# Altium schematic sheet Instrument_Design.SchDoc
size A2; SheetNumber: 1; SheetTotal: 1
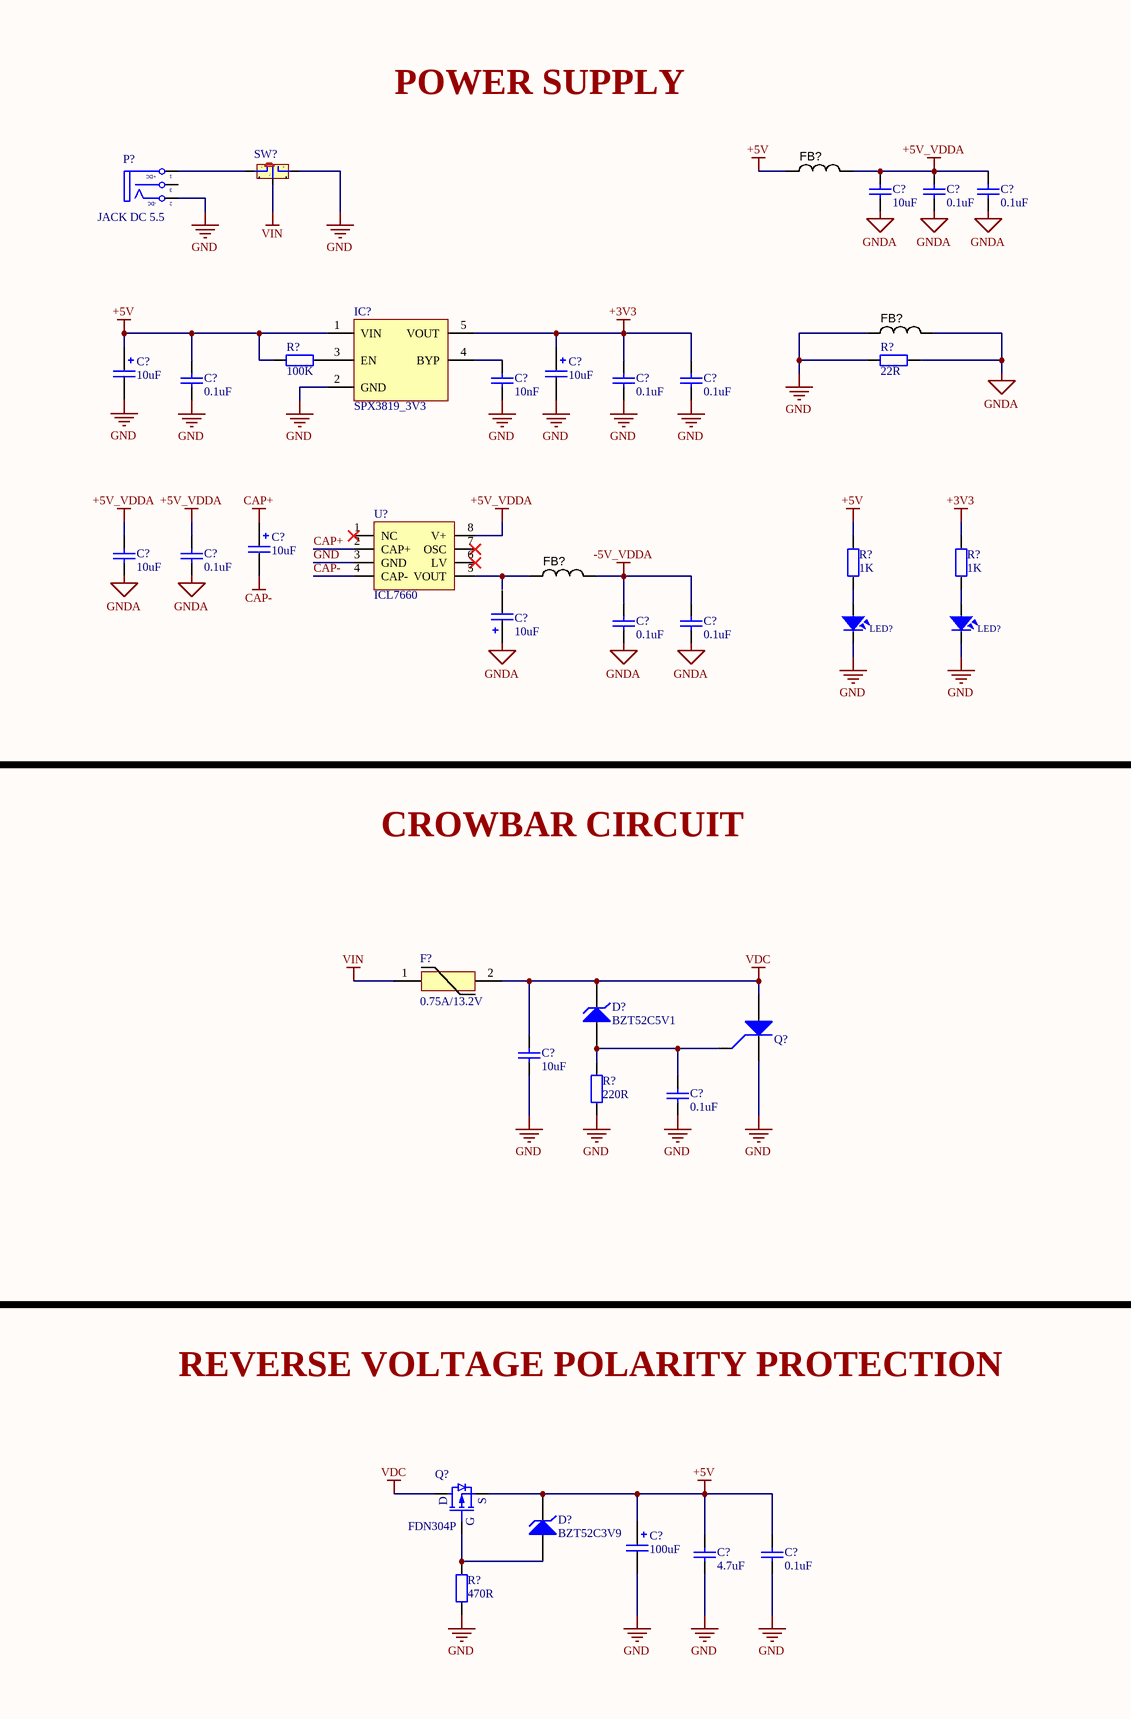
[diagram p0: Instrument_Design.SchDoc, left]
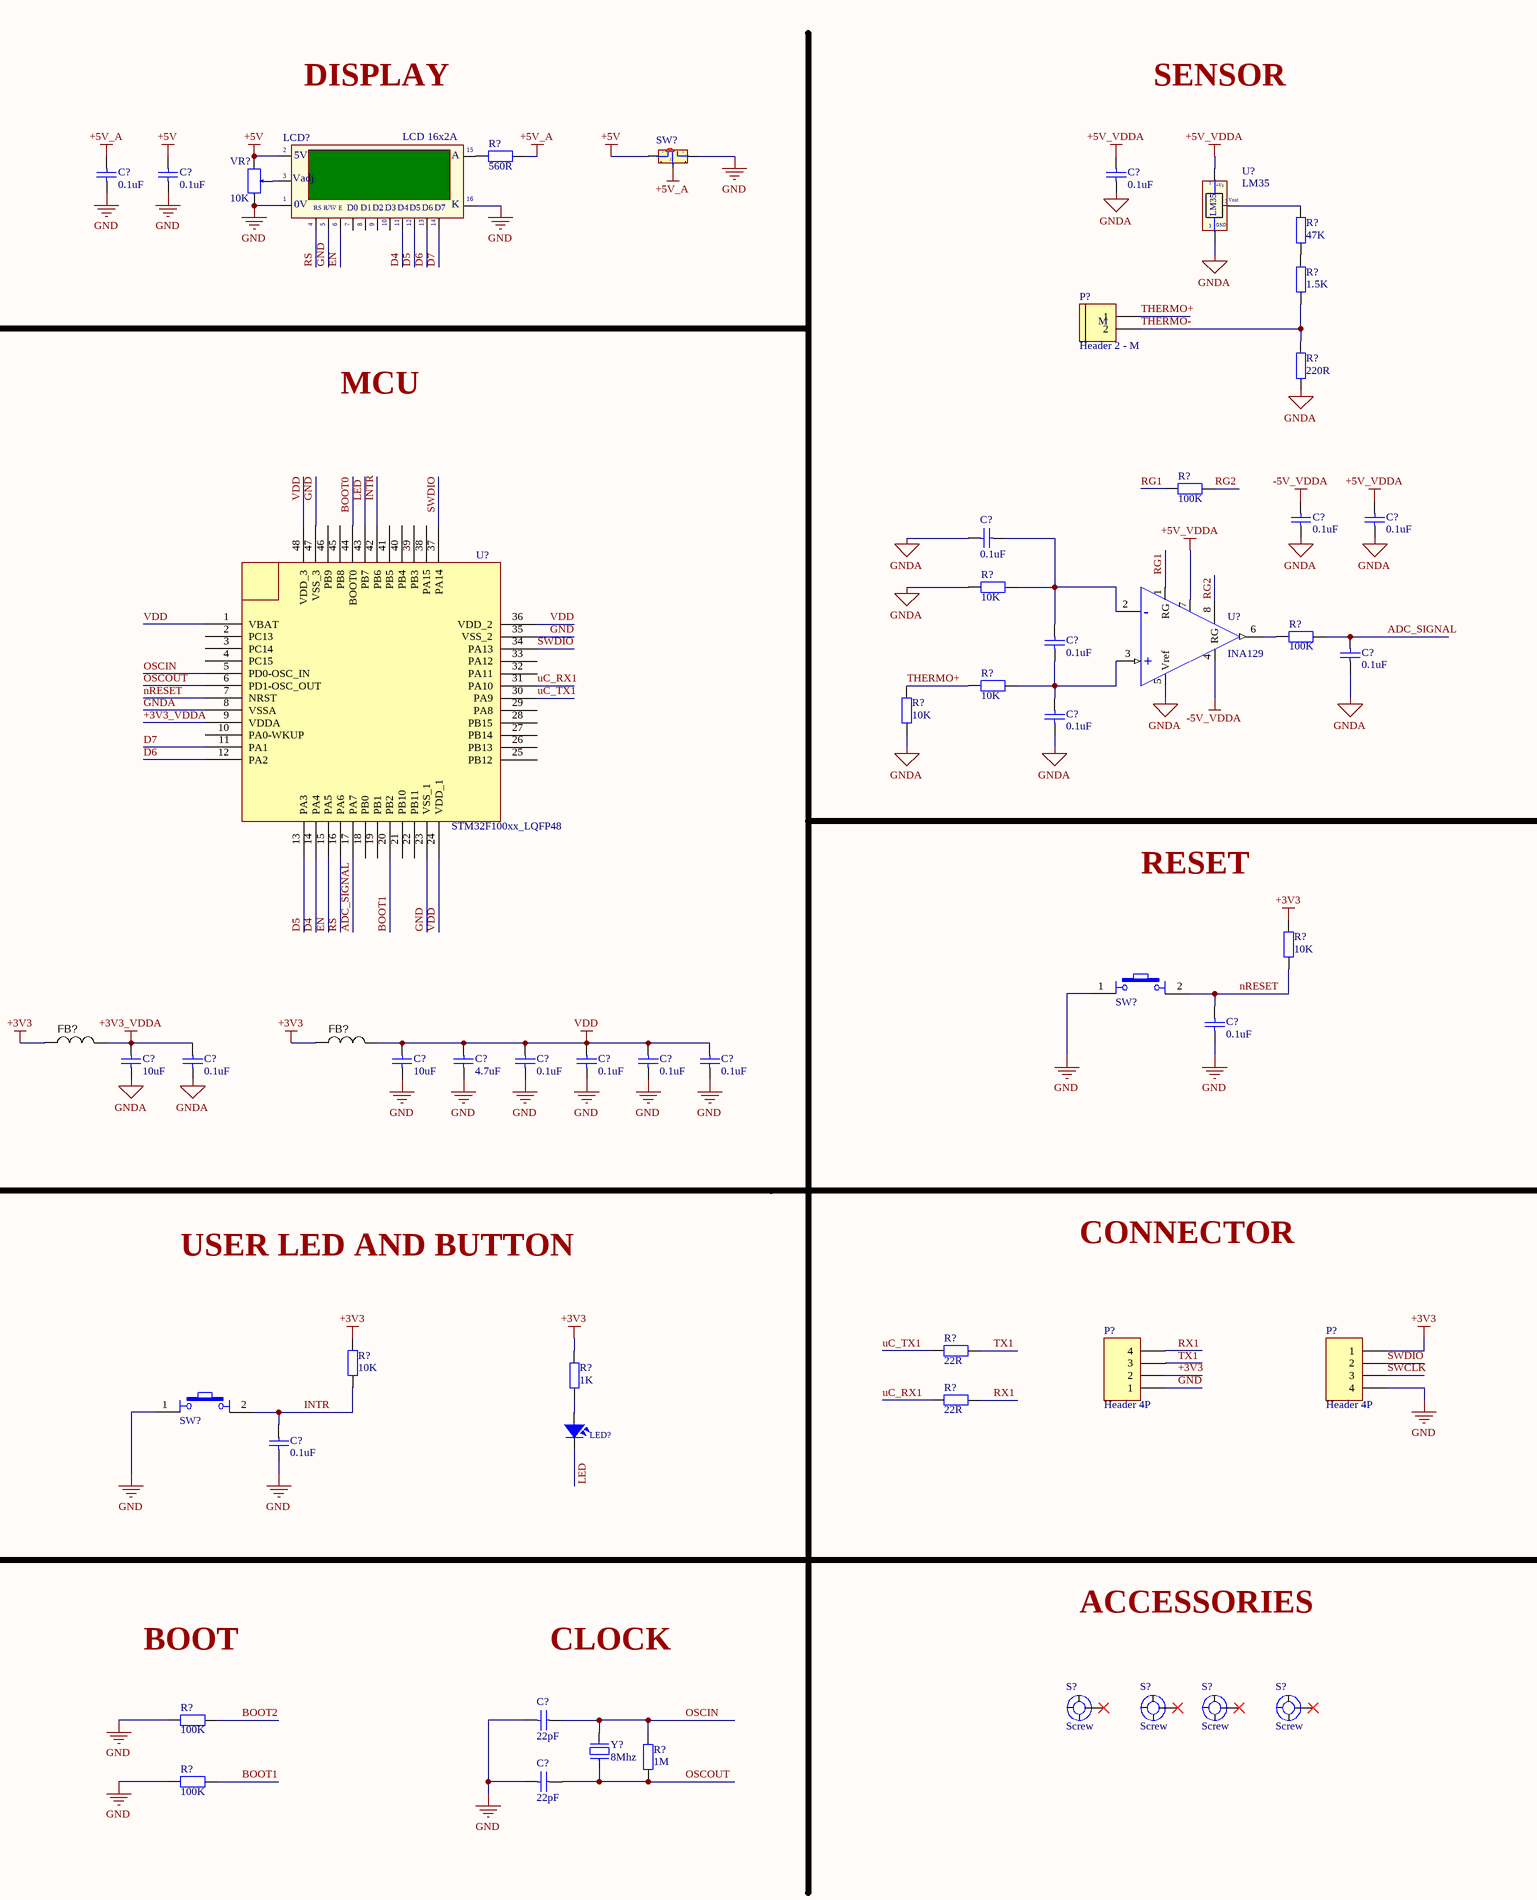
[diagram p1: Instrument_Design.SchDoc, right]

## Parts
(Parts that share a designator on the sheet are numbered #1, #2 ... from top to bottom, then left to right.)
C?#1  10uF  [CAP_CERAMIC_0805(2012mm)]
C?#2  0.1uF  [CAP_CERAMIC_0805(2012mm)]
C?#3  0.1uF  [CAP_CERAMIC_0805(2012mm)]
C?#4  0.1uF  [CAP_CERAMIC_0805(2012mm)]
C?#5  0.1uF  [CAP_CERAMIC_0805(2012mm)]
C?#6  0.1uF  [CAP_CERAMIC_0805(2012mm)]
C?#7  0.1uF  [CAP_CERAMIC_0805(2012mm)]
C?#8  10nF  [CAP_CERAMIC_0805(2012mm)]
C?#9  0.1uF  [CAP_CERAMIC_0805(2012mm)]
C?#10  0.1uF  [CAP_CERAMIC_0805(2012mm)]
C?#11  10uF  [CAP_TANTAL_2312(6032)]
C?#12  10uF  [CAP_TANTAL_2312(6032)]
C?#13  10uF  [CAP_CERAMIC_0805(2012mm)]
C?#14  0.1uF  [CAP_CERAMIC_0805(2012mm)]
C?#15  10uF  [CAP_TANTAL_2312(6032)]
C?#16  0.1uF  [CAP_CERAMIC_0805(2012mm)]
C?#17  0.1uF  [CAP_CERAMIC_0805(2012mm)]
C?#18  0.1uF  [CAP_CERAMIC_0805(2012mm)]
C?#19  0.1uF  [CAP_CERAMIC_0805(2012mm)]
C?#20  0.1uF  [CAP_CERAMIC_0805(2012mm)]
C?#21  10uF  [CAP_TANTAL_2312(6032)]
C?#22  0.1uF  [CAP_CERAMIC_0805(2012mm)]
C?#23  0.1uF  [CAP_CERAMIC_0805(2012mm)]
C?#24  0.1uF  [CAP_CERAMIC_0805(2012mm)]
C?#25  10uF  [CAP_CERAMIC_0805(2012mm)]
C?#26  0.1uF  [CAP_CERAMIC_0805(2012mm)]
C?#27  0.1uF  [CAP_CERAMIC_0805(2012mm)]
C?#28  10uF  [CAP_CERAMIC_0805(2012mm)]
C?#29  0.1uF  [CAP_CERAMIC_0805(2012mm)]
C?#30  10uF  [CAP_CERAMIC_0805(2012mm)]
C?#31  4.7uF  [CAP_CERAMIC_0805(2012mm)]
C?#32  0.1uF  [CAP_CERAMIC_0805(2012mm)]
C?#33  0.1uF  [CAP_CERAMIC_0805(2012mm)]
C?#34  0.1uF  [CAP_CERAMIC_0805(2012mm)]
C?#35  0.1uF  [CAP_CERAMIC_0805(2012mm)]
C?#36  4.7uF  [CAP_CERAMIC_0805(2012mm)]
C?#37  0.1uF  [CAP_CERAMIC_0805(2012mm)]
C?#38  100uF  [CAP_TANTAL_2312(6032)]
C?#39  0.1uF  [CAP_CERAMIC_0805(2012mm)]
C?#40  22pF  [CAP_CERAMIC_0805(2012mm)]
C?#41  22pF  [CAP_CERAMIC_0805(2012mm)]
D?#1  BZT52C5V1  [SOD-123]
D?#2  BZT52C3V9  [SOD-123]
F?  0.75A/13.2V  [FUSE_1812(4532)]
FB?#1  (no value)  [FBC2012N]
FB?#2  (no value)  [FBC2012N]
FB?#3  (no value)  [FBC2012N]
FB?#4  (no value)  [FBC2012N]
FB?#5  (no value)  [FBC2012N]
IC?  SPX3819_3V3  [SOT23-5]
LCD?  LCD 16x2A  [LCD16X2]
LED?#1  LED SMD  [SM-LED-0805-Blue]  (value not drawn)
LED?#2  LED SMD  [SM-LED-0805-Blue]  (value not drawn)
LED?#3  LED SMD  [SM-LED-0805-Blue]  (value not drawn)
P?#1  JACK DC 5.5  [JACK DC 5.5]
P?#2  Header 2 - M  [Medium - Header 2]
P?#3  Header 4P  [HDR1X4]
P?#4  Header 4P  [HDR1X4]
Q?#1  MCR22-6  [TO-92]  (value not drawn)
Q?#2  FDN304P  [SOT23_3]
R?#1  560R  [RESC-0805 (2012)]
R?#2  47K  [RESC-0805 (2012)]
R?#3  1.5K  [RESC-0805 (2012)]
R?#4  100K  [RESC-0805 (2012)]
R?#5  22R  [RESC-0805 (2012)]
R?#6  220R  [RESC-0805 (2012)]
R?#7  100K  [RESC-0805 (2012)]
R?#8  1K  [RESC-0805 (2012)]
R?#9  1K  [RESC-0805 (2012)]
R?#10  10K  [RESC-0805 (2012)]
R?#11  100K  [RESC-0805 (2012)]
R?#12  10K  [RESC-0805 (2012)]
R?#13  10K  [RESC-0805 (2012)]
R?#14  10K  [RESC-0805 (2012)]
R?#15  220R  [RESC-0805 (2012)]
R?#16  22R  [RESC-0805 (2012)]
R?#17  10K  [RESC-0805 (2012)]
R?#18  1K  [RESC-0805 (2012)]
R?#19  22R  [RESC-0805 (2012)]
R?#20  470R  [RESC-0805 (2012)]
R?#21  100K  [RESC-0805 (2012)]
R?#22  1M  [RESC-0805 (2012)]
R?#23  100K  [RESC-0805 (2012)]
S?#1  Screw  [Screw 3 small]
S?#2  Screw  [Screw 3 small]
S?#3  Screw  [Screw 3 small]
S?#4  Screw  [Screw 3 small]
SW?#1  SS-12F44  [SW102]  (value not drawn)
SW?#2  SS-12F44  [SW102]  (value not drawn)
SW?#3  Nut Nhan 4 Chan Cam 6x6  [Nut Nhan 4 Chan Cam 6x6]  (value not drawn)
SW?#4  Nut Nhan 4 Chan Cam 6x6  [Nut Nhan 4 Chan Cam 6x6]  (value not drawn)
U?#1  LM35  [QTO-92]
U?#2  STM32F100xx_LQFP48  [STM32_LQPF48]
U?#3  ICL7660  [DIP.100/8/W.300/L.400]
U?#4  INA129  [SOIC-8]
VR?  10K  [Bien Tro Vi Chinh Dung]
Y?  8Mhz  [Thach Anh 2 chan cam]

## Nets
+3V3: C?#9.1 C?#10.1 C?#12.1 FB?#4.1 FB?#5.1 IC?.5(VOUT) P?#3.1 P?#4.2 R?#9.1 R?#14.2 R?#17.2 R?#18.1
+3V3_VDDA: C?#28.1 C?#29.1 FB?#4.2 U?#2.9(VDDA)
+5V: C?#5.1 C?#7.1 C?#11.1 C?#36.1 C?#37.1 C?#38.1 D?#2.2(K) FB?#1.1 IC?.1(VIN) LCD?.2(VDD) Q?#2.2(S) R?#4.2 R?#8.1 SW?#2.1 VR?.1
+5V_A: C?#4.1 R?#1.1 SW?#2.2
+5V_VDDA: C?#1.1 C?#2.1 C?#3.1 C?#6.1 C?#13.1 C?#14.1 C?#17.1 FB?#1.2 U?#1.1(+Vs) U?#3.8(V+) U?#4.7(V+)
-5V_VDDA: C?#16.1 C?#19.1 C?#20.1 FB?#3.2 U?#4.4(V-)
CAP+: C?#15.1 U?#3.2(CAP+)
CAP-: C?#15.2 U?#3.4(CAP-)
GND: C?#4.2 C?#5.2 C?#7.2 C?#8.2 C?#9.2 C?#10.2 C?#11.2 C?#25.2 C?#26.2 C?#27.2 C?#30.2 C?#31.2 C?#32.2 C?#33.2 C?#34.2 C?#35.2 C?#36.2 C?#37.2 C?#39.2 C?#40.2 C?#41.2 FB?#2.1 IC?.2(GND) LCD?.1(GND) LCD?.5(R/~{W}) LCD?.16(K) LED?#1.2 LED?#2.2 P?#1.2(TN) P?#3.4 P?#4.1 Q?#1.1(K) R?#5.2 R?#15.2 R?#20.2 R?#21.2 R?#23.2 SW?#1.3 SW?#2.3 SW?#3.1 SW?#4.1 U?#2.23(VSS_1) U?#2.35(VSS_2) U?#2.47(VSS_3) U?#3.3(GND) VR?.3
GNDA: C?#1.2 C?#2.2 C?#3.2 C?#6.2 C?#13.2 C?#14.2 C?#16.2 C?#17.2 C?#18.1 C?#19.2 C?#20.2 C?#21.1 C?#23.2 C?#24.2 C?#28.2 C?#29.2 FB?#2.2 R?#5.1 R?#6.1 R?#10.2 R?#13.1 U?#1.3(-) U?#2.8(VSSA) U?#4.5(Vref)
VDC: C?#25.1 D?#1.2(K) F?.2 Q?#1.3(A) Q?#2.3(D)
VDD: C?#30.1 C?#31.1 C?#32.1 C?#33.1 C?#34.1 C?#35.1 FB?#5.2 U?#2.1(VBAT) U?#2.24(VDD_1) U?#2.36(VDD_2) U?#2.48(VDD_3)
VIN: F?.1 SW?#1.2
ADC_SIGNAL: C?#23.1 R?#11.1 U?#2.17(PA7)
BOOT0: U?#2.44(BOOT0)
BOOT1: R?#23.1 U?#2.20(PB2)
BOOT2: R?#21.1
D4: LCD?.11(D4) U?#2.14(PA4)
D5: LCD?.12(D5) U?#2.13(PA3)
D6: LCD?.13(D6) U?#2.12(PA2)
D7: LCD?.14(D7) U?#2.11(PA1)
EN: LCD?.6(~{EN}) U?#2.15(PA5)
INTR: C?#39.1 R?#17.1 SW?#4.2 U?#2.42(PB6)
LED: LED?#3.2 U?#2.43(PB7)
nRESET: C?#27.1 R?#14.1 SW?#3.2 U?#2.7(NRST)
OSCIN: C?#40.1 R?#22.2 U?#2.5(PD0-OSC_IN) Y?.2
OSCOUT: C?#41.1 R?#22.1 U?#2.6(PD1-OSC_OUT) Y?.1
RG1: R?#7.2 U?#4.1(RG)
RG2: R?#7.1 U?#4.8(RG)
RS: LCD?.4(RS) U?#2.16(PA6)
RX1: P?#4.4 R?#19.1
SWCLK: P?#3.3
SWDIO: P?#3.2 U?#2.34(PA13) U?#2.37(PA14)
THERMO+: P?#2.1 R?#12.2 R?#13.2
THERMO-: P?#2.2 R?#3.1 R?#6.2
TX1: P?#4.3 R?#16.1
uC_RX1: R?#19.2 U?#2.31(PA10)
uC_TX1: R?#16.2 U?#2.30(PA9)
NetC?#8_1: C?#8.1 IC?.4(BYP)
NetC?#18_2: C?#18.2 C?#22.1 R?#10.1 U?#4.2(-)
NetC?#22_2: C?#22.2 C?#24.1 R?#12.1 U?#4.3(+)
NetC?#26_1: C?#26.1 D?#1.1(A) Q?#1.2(G) R?#15.1
NetD?#2_1: D?#2.1(A) Q?#2.1(G) R?#20.1
NetFB?#3_1: FB?#3.1 U?#3.5(VOUT)
NetIC?_3: IC?.3(EN) R?#4.1
NetLCD?_3: LCD?.3(VAdj) VR?.2
NetLCD?_15: LCD?.15(A) R?#1.2
NetLED?#1_1: LED?#1.1 R?#8.2
NetLED?#2_1: LED?#2.1 R?#9.2
NetLED?#3_1: LED?#3.1 R?#18.2
NetP?#1_1: P?#1.1(T) SW?#1.1
NetR?#2_1: R?#2.1 R?#3.2
NetR?#2_2: R?#2.2 U?#1.2(Vout)
NetR?#11_2: R?#11.2 U?#4.6(Vout)

Not connected (* = marked no-connect by the designer): C?#12 2; C?#21 2; C?#38 2; LCD? 7(D0) 8(D1) 9(D2) 10(D3); P?#1 3(S); S?#1 1*; S?#2 1*; S?#3 1*; S?#4 1*; SW?#1 4 5; SW?#2 4 5; U?#2 2(PC13) 3(PC14) 4(PC15) 10(PA0-WKUP) 18(PB0) 19(PB1) 21(PB10) 22(PB11) 25(PB12) 26(PB13) 27(PB14) 28(PB15) 29(PA8) 32(PA11) 33(PA12) 38(PA15) 39(PB3) 40(PB4) 41(PB5) 45(PB8) 46(PB9); U?#3 1(NC)* 6(LV)* 7(OSC)*

## Notes on the sheet
- POWER SUPPLY
- DISPLAY
- SENSOR
- MCU
- CROWBAR CIRCUIT
- RESET
- REVERSE VOLTAGE POLARITY PROTECTION
- USER LED AND BUTTON
- CONNECTOR
- ACCESSORIES
- BOOT
- CLOCK
- Labels drawn without touching a wire or pin: GND
- (in symbol Header 2 - M) M
- (in symbol JACK DC 5.5) +DC; -DC
- (in symbol LCD16x2A) 5V; Vadj; |; 0V; R/W; E
- (in symbol LM35) GND

## Library data of the parts
C?#1-C?#10 C?#13 C?#14 C?#16-C?#20 C?#22-C?#37 C?#39-C?#41 = C0805(2012): Capacitor SMD 0805(2012); Value: 33p; Published: 8-Jun-2000; LatestRevisionDate: 17-Jul-2002; LatestRevisionNote: Re-released for DXP Platform.; PackageReference: RAD-0.3; Publisher: Altium Limited
C?#11 C?#12 C?#15 C?#21 C?#38 = 293D106X9025C2TE3: CAP TANT 10uF 25V 10% 2312; MPN: 293D106X9025C2TE3;T491C106K025AT7280; CompanyID: VT-00020; Solder: SMT; Value: 106/25V; Category: CAPACITOR; PinCount: 2
D?#1 D?#2 = MMSZ3V6T1G: DIODE ZENER 3.6V 500MW SOD123; MFR: ON; Solder: SMT; Value: 3.6V; MPN: MMSZ3V6T1G
F? = 1812L150/24MR: FUSE PTC RESETTABLE 24V 1.50A 1812L; Solder: SMT; Value: 24V/1.5A; CompanyID: VT-00870; MPN: 1812L150/24MR
FB?#1-FB?#5 = FERRITE_2K2-100MHz_0805: Ferrite bead 2.2K Ohm at 100 MHz 200mA 0805 SMD; Manufacturer 1: Laird-Signal Integrity Products; Ratings: 200 mA; 800 mOhm DC; Impedance @ Frequency: 600 Ohm @ 100MHz; DC Resistance (DCR): 800 mOhm Max; Filter Type: Differential Mode - Single; SCDType: source; Size / Dimension: 0.063" L x 0.031" W (1.60mm x 0.80mm); Current Rating: 200mA; Package / Case: 0805 (2012 Metric); Height (Max): 0.043" (1.09mm); ComponentLink1URL: http://www.lairdtech.com/WorkArea/linkit.aspx?LinkIdentifier=id&ItemID=4879; ComponentLink1Description: http://www.lairdtech.com/WorkArea/linkit.aspx?LinkIdentifier=id&ItemID=4879; Supplier 1: Digi-Key; Supplier Part Number 1: 240-2562-1-ND; Mounting Type: Surface Mount
LCD? = LCD16x2A: LCD dipslay 16 char, 2 line; Value: LCD16x2A
LED?#1-LED?#3 = LED SMD 0805
P?#1 = JACK DC 5.5: Value: Jac DC
P?#2 = Header 2 - M: Header, 2-Pin, Medium; LatestRevisionDate: 17-Jul-2002; LatestRevisionNote: Re-released for DXP Platform.; Publisher: Altium Limited
P?#3 P?#4 = Header 4x1: Header, 4 Pin Pitch 2.54mm; MPN: S1012EC-40-ND; CompanyID: VT-00125; Solder: WAVE; Value: Header 4P
Q?#2 = AO3415: MOSFET P-CH 20V 4A SOT23; MFR: Alpha & Omega Semiconductor Inc.; Value: 20V/4A; Solder: SMT; MPN: AO3415
R?#1-R?#23 = RC0805FR-07100KL: RES SMD 100K OHM 1% 1/8W 0805; Solder: SMT; CompanyID: VT-00006; Value: 100K; MPN: RC0805FR-07100KL; Category: RESISTOR
SW?#1 SW?#2 = SW102A: Switch 102 on Broad; Value: Switch 102 On Board
SW?#3 SW?#4 = Nut Nhan 4 Chan Cam 6x6: Nut Nhan 4 Chan 6x6mm; Ten: Nút Nhấn 4 Chân 6x6x5MM DIP; Ma_Hang: MH004584
U?#1 = LM35: Teminal; Value: LM35
U?#3 = ICL7660: CMOS Voltage Converters; Creator: Nguyen Ba Bien
U?#4 = INA129: IC INST AMP 1 CIRCUIT 8SOIC; MPN: INA129UA/2K5; MFR: TI; Solder: SMT; Value: INA129; Category: IC; PinCount: 8
VR? = Bien Tro Tinh Chinh 10K Dung: Cắm; Ma_Hang: MH003232; Ten_Linh_Kien: Biến Trở VR 103-10K 3296W; Don_Vi: Con; Kieu_Chan: *; Chung_Loai: Cắm; Ghi_Chu: *
Y? = Thach Anh 2 chan Cam: Crystal For all Crystal 2pin.; Value: 4Mhz